# Altium schematic sheet Sheet1.SchDoc
size A4
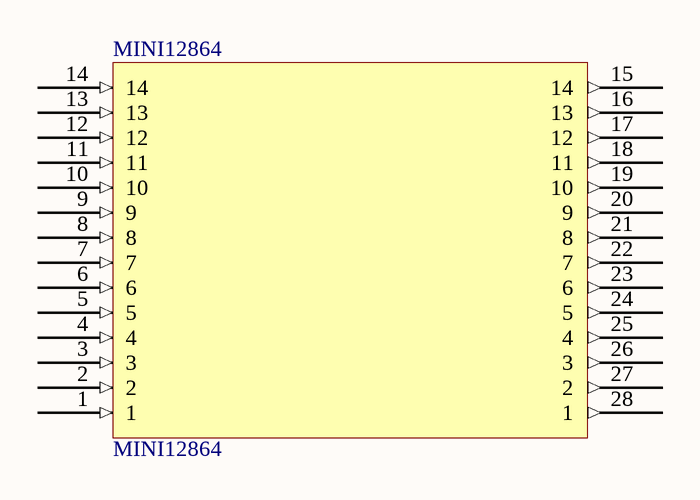
[diagram p0: Sheet1.SchDoc]

## Parts
MINI12864  MINI12864  [MINI12864]

## Nets

Not connected (* = marked no-connect by the designer): MINI12864 1 2 3 4 5 6 7 8 9 10 11 12 13 14 15(14) 16(13) 17(12) 18(11) 19(10) 20(9) 21(8) 22(7) 23(6) 24(5) 25(4) 26(3) 27(2) 28(1)

## Library data of the parts
MINI12864 = Component_2